# Altium schematic sheet Copia de UC3844 - CON TEST .SCHDOC
size 508 x 241 mm
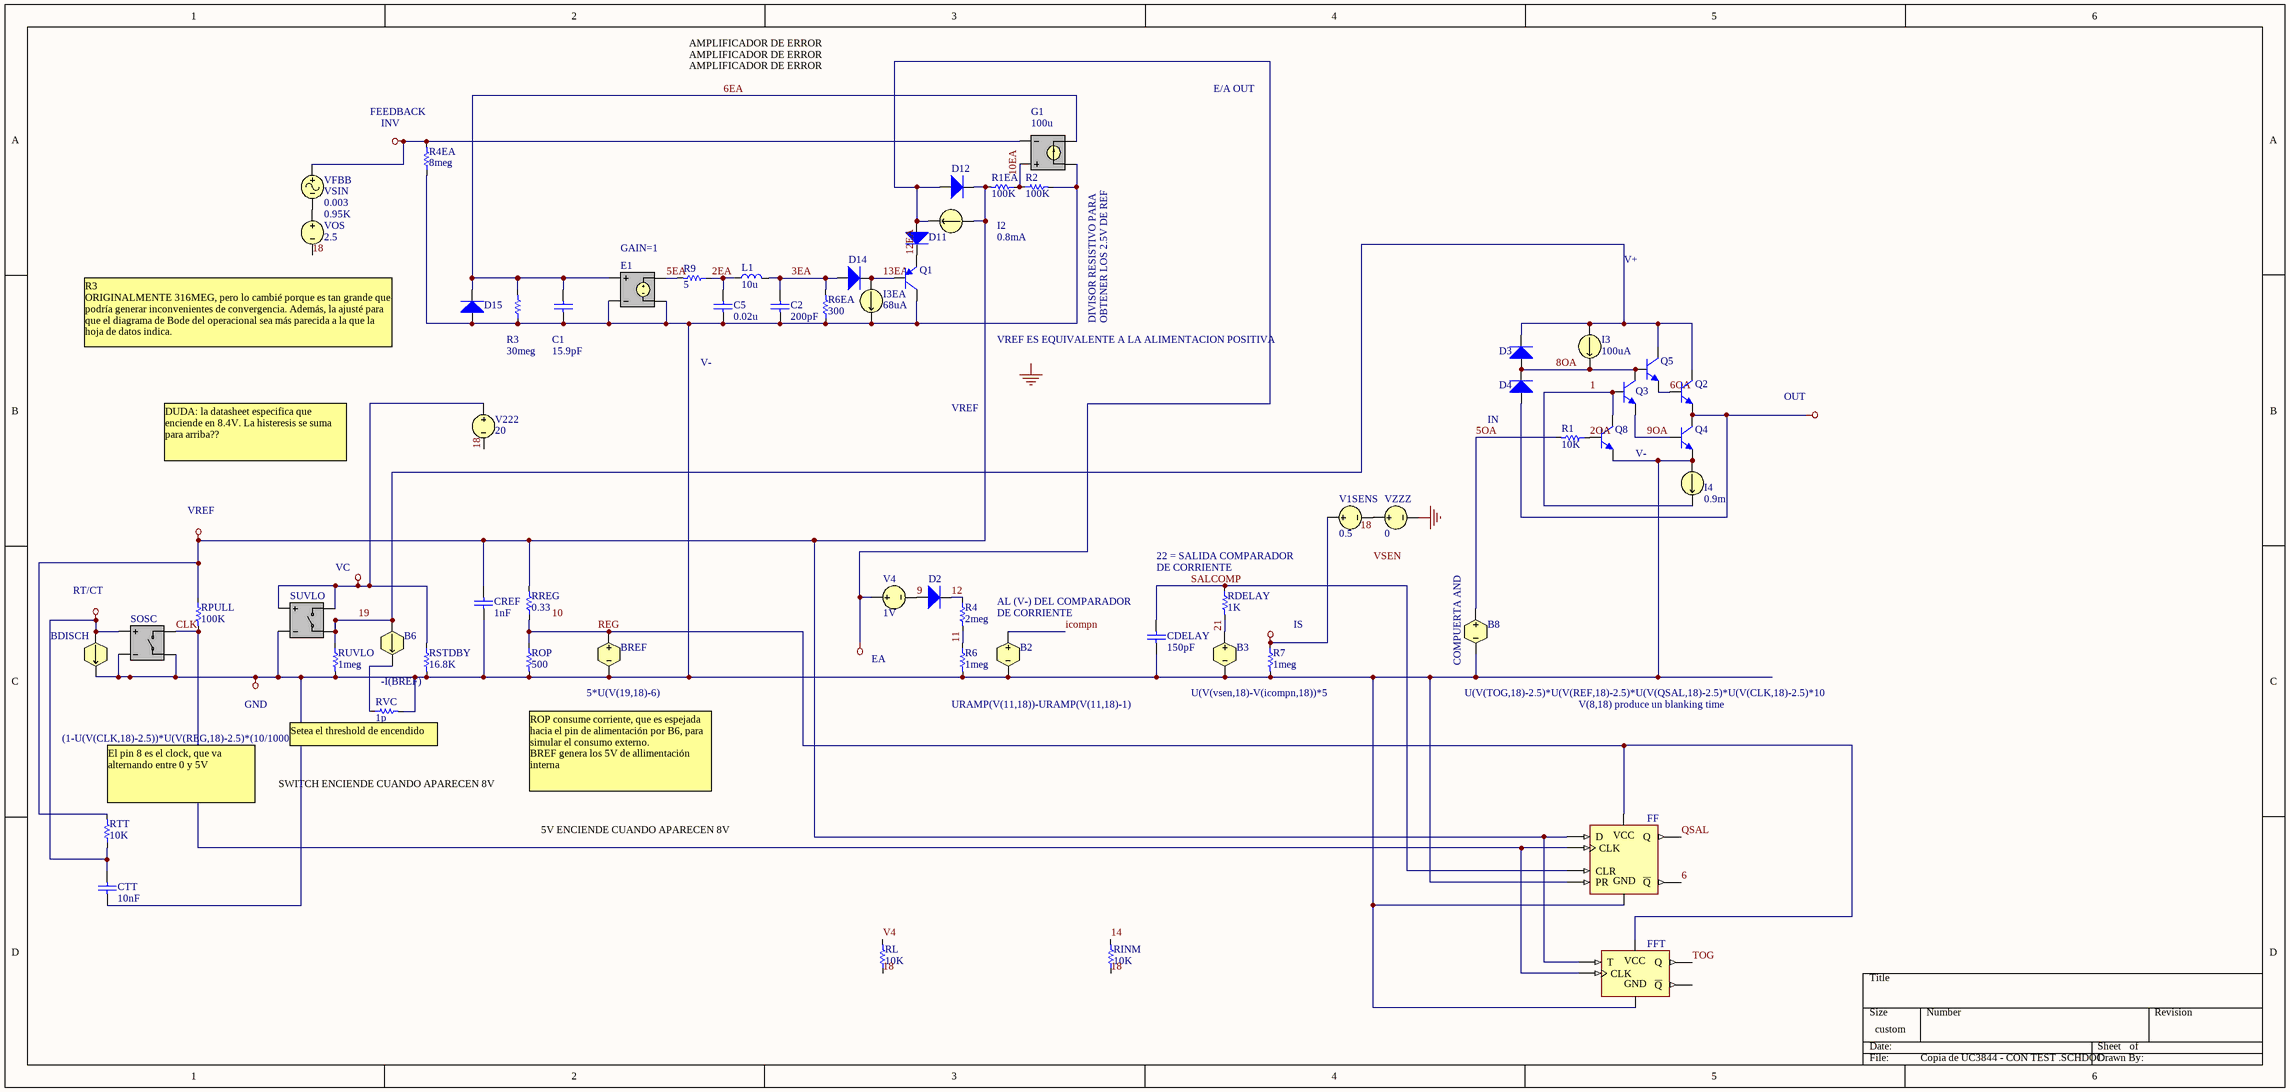
[diagram p0: Copia de UC3844 - CON TEST .SCHDOC]

## Parts
B2  Equation: URAMP(V(11,18))-URAMP(V(11,18)-1)  (hidden comment: BVSRC)
B3  Equation: U(V(vsen,18)-V(icompn,18))*5  (hidden comment: BVSRC)
B6  Equation: -I(BREF)  (hidden comment: BISRC)
B8  Equation: U(V(TOG,18)-2.5)*U(V(REF,18)-2.5)*U(V(QSAL,18)-2.5)*U(V(CLK,18)-2.5)*10  (hidden comment: BVSRC)
BDISCH  Equation: (1-U(V(CLK,18)-2.5))*U(V(REG,18)-2.5)*(10/1000)  (hidden comment: BISRC)
BREF  Equation: 5*U(V(19,18)-6)  (hidden comment: BVSRC)
C1  value 15.9pF  [0805]  (hidden comment: Cap)
C2  value 200pF  [0805]  (hidden comment: Cap)
C5  value 0.02u  [0805]  (hidden comment: Cap)
CDELAY  value 150pF  [0805]  (hidden comment: Cap)
CREF  value 1nF  [0805]  (hidden comment: Cap)
CTT  value 10nF  [0805]  (hidden comment: Cap)
D2  Diode  [diode400]  (value not drawn)
D3  Diode  [diode400]  (value not drawn)
D4  Diode  [diode400]  (value not drawn)
D11  Diode  [diode400]  (value not drawn)
D12  Diode  [diode400]  (value not drawn)
D14  Diode  [diode400]  (value not drawn)
D15  Diode  [diode400]  (value not drawn)
E1  ESRC  (value not drawn)
FF  FFSRV2  (value not drawn)
FFT  FFT  (value not drawn)
G1  Gain: 100u  (hidden comment: GSRC)
I2  value 0.8mA  (hidden comment: ISRC)
I3  value 100uA  (hidden comment: ISRC)
I3EA  value 68uA  (hidden comment: ISRC)
I4  value 0.9m  (hidden comment: ISRC)
L1  value 10u  [TOROIDE TN14-9-5]  (hidden comment: Inductor2)
Q1  PNP  [SOT23]  (value not drawn)
Q2  NPN  [SOT23]  (value not drawn)
Q3  NPN  [SOT23]  (value not drawn)
Q4  NPN  [SOT23]  (value not drawn)
Q5  NPN  [SOT23]  (value not drawn)
Q8  NPN  [SOT23]  (value not drawn)
R1  value 10K  [0805]  (hidden comment: Res)
R1EA  value 100K  [0805]  (hidden comment: Res)
R2  value 100K  [0805]  (hidden comment: Res)
R3  value 30meg  [0805]  (hidden comment: Res)
R4  value 2meg  [0805]  (hidden comment: Res)
R4EA  value 8meg  [0805]  (hidden comment: Res)
R6  value 1meg  [0805]  (hidden comment: Res)
R6EA  value 300  [0805]  (hidden comment: Res)
R7  value 1meg  [0805]  (hidden comment: Res)
R9  value 5  [0805]  (hidden comment: Res)
RDELAY  value 1K  [0805]  (hidden comment: Res)
RINM  value 10K  [0805]  (hidden comment: Res)
RL  value 10K  [0805]  (hidden comment: Res)
ROP  value 500  [0805]  (hidden comment: Res)
RPULL  value 100K  [0805]  (hidden comment: Res)
RREG  value 0.33  [0805]  (hidden comment: Res)
RSTDBY  value 16.8K  [0805]  (hidden comment: Res)
RTT  value 10K  [0805]  (hidden comment: Res)
RUVLO  value 1meg  [0805]  (hidden comment: Res)
RVC  value 1p  [0805]  (hidden comment: Res)
SOSC  VSW  (value not drawn)
SUVLO  VSW  (value not drawn)
V1SENS  value 0.5  (hidden comment: VSRC)
V4  value 1V  (hidden comment: VSRC)
V222  value 20  (hidden comment: VSRC)
VFBB  VSIN  Amplitude: 0.003  Frequency: 0.95K
VOS  value 2.5  (hidden comment: VSRC)
VZZZ  value 0  (hidden comment: VSRC)

## Nets
18: B2.2 B3.2 B8.2 BDISCH.2 BREF.2 C1.1 C2.1 C5.1 CDELAY.1 CREF.1 CTT.1 D15.1 E1.2(NC-) E1.4(N-) FF.4(PR) FF.7(GND) FFT.6(GND) G1.3(N+) I3EA.2 I4.1 Q1.1(C) Q4.3(E) Q8.3(E) R2.2 R3.1 R4EA.1 R6.2 R6EA.1 R7.2 RINM.1 RL.1 ROP.2 RSTDBY.2 RUVLO.2 RVC.2 SOSC.2(N1-) SOSC.4(N2-) SUVLO.2(N1-) V1SENS.2 V222.2 VOS.2 VZZZ.1
ALIM: RSTDBY.1 SUVLO.1(N1+) SUVLO.3(N2+) V222.1
EAOUT: D11.1 D12.1 I2.2 V4.1
FEED: G1.2(NC-) R4EA.2 VFBB.1
GND: VZZZ.2
OUT: D4.1 Q2.3(E) Q4.1(C)
REF: CREF.2 D12.2 FF.2(D) FFT.1(T) I2.1 R1EA.2 RPULL.1 RREG.2 RTT.2
RTCT: BDISCH.1 CTT.2 RTT.1 SOSC.1(N1+)
VSEN: R7.1 V1SENS.1
1: I4.2 Q3.2(B) Q8.1(C)
2EA: C5.2 L1.1 R9.1
2OA: Q8.2(B) R1.1
3EA: C2.2 D14.1 L1.2 R6EA.2
5EA: E1.3(N+) R9.2
5OA: B8.1 R1.2
6: FF.6(~{Q})
6EA: C1.2 D15.2 E1.1(NC+) G1.4(N-) R3.2
6OA: Q2.2(B) Q5.3(E)
8OA: D3.1 D4.2 I3.2 Q3.1(C) Q5.2(B)
9: D2.1 V4.2
9OA: Q3.3(E) Q4.2(B)
10EA: G1.1(NC+) R1EA.1 R2.1
11: R4.2 R6.1
12: D2.2 R4.1
12EA: D11.2 Q1.3(E)
13EA: D14.2 I3EA.1 Q1.2(B)
14: RINM.2
19: B6.1 D3.2 I3.1 Q2.1(C) Q5.1(C) RUVLO.1 SUVLO.4(N2-)
21: B3.1 RDELAY.2
CLK: FF.3(CLK) FFT.2(CLK) RPULL.2 SOSC.3(N2+)
icompn: B2.1
QSAL: FF.5(Q)
REG: BREF.1 FF.14(VCC) FFT.5(VCC) ROP.1 RREG.1
SALCOMP: CDELAY.2 FF.1(CLR) RDELAY.1
TOG: FFT.3(Q)
V4: RL.2
NetB6_2: B6.2 RVC.1
NetVFBB_2: VFBB.2 VOS.1

Not connected (* = marked no-connect by the designer): FFT 4(~{Q})

## Notes on the sheet
- AMPLIFICADOR DE ERROR
- (near R4EA) FEEDBACK
- (near R4EA) INV
- E/A OUT
- (near E1) GAIN=1
- V+
- (near VOS) R3
  ORIGINALMENTE 316MEG, pero lo cambié porque es tan grande que podría generar inconvenientes de convergencia. Además, la ajusté para que el diagrama de Bode del operacional sea más parecida a la que la hoja de datos indica.
- V-
- VREF ES EQUIVALENTE A LA ALIMENTACION POSITIVA
- DIVISOR RESISTIVO PARA
- OBTENER LOS 2.5V DE REF
- VREF
- (near D4) IN
- OUT
- DUDA: la datasheet especifica que enciende en 8.4V. La histeresis se suma para arriba??
- RT/CT
- (near SUVLO) VC
- (near RDELAY) 22 = SALIDA COMPARADOR
- (near RDELAY) DE CORRIENTE
- AL (V-) DEL COMPARADOR
- DE CORRIENTE
- (near R7) IS
- GND
- EA
- (near B8) COMPUERTA AND
- V(8,18) produce un blanking time
- (near RVC) Setea el threshold de encendido
- (near RTT) El pin 8 es el clock, que va alternando entre 0 y 5V
- SWITCH ENCIENDE CUANDO APARECEN 8V
- ROP consume corriente, que es espejada hacia el pin de alimentación por B6, para simular el consumo externo.
  BREF genera los 5V de allimentación interna
- 5V ENCIENDE CUANDO APARECEN 8V
- Labels drawn without touching a wire or pin: 10, GND, VSEN

## Library data of the parts
B2 B3 B8 BREF = BVSRC: Non-Linear Dependent Voltage Source; Note: PCB Footprint - Not required; Published: 8-Jun-2000; Revision: 17-Jul-2002: Re-released for DXP Platform.; Package Reference: Not Applicable; Publisher: Altium Limited
B6 BDISCH = BISRC: Non-Linear Dependent Current Source; Note: PCB Footprint - Not required; Published: 8-Jun-2000; Revision: 17-Jul-2002: Re-released for DXP Platform.; Package Reference: Not Applicable; Publisher: Altium Limited
C1 C2 C5 CDELAY CREF CTT = Cap: Capacitor; Voltage: 50V; Price: 0.25; Technology: Ceramic
D2-D4 D11 D12 D14 D15 = Diode: Diodo; Price: ?
E1 = ESRC: Voltage Controlled Voltage Source; Note: PCB Footprint - Not required; Published: 8-Jun-2000; Revision: 17-Jul-2002: Re-released for DXP Platform.; Package Reference: Not Applicable; Publisher: Altium Limited
FF = FFSRV2: D-Type Positive-Edge-Triggered Flip-Flop with Clear and Preset (simulación); Revision: 17-Jul-2002: Re-released for DXP Platform.
FFT = FFT: Positive-Edge-Triggered Flip-Flop T (simulación); Revision: 17-Jul-2002: Re-released for DXP Platform.
G1 = GSRC: Voltage Controlled Current Source; Note: PCB Footprint - Not required; Published: 8-Jun-2000; Revision: 17-Jul-2002: Re-released for DXP Platform.; Package Reference: Not Applicable; Publisher: Altium Limited
I2 I3 I3EA I4 = ISRC: Current Source; Note: PCB Footprint - Not required; Published: 8-Jun-2000; Revision: 17-Jul-2002: Re-released for DXP Platform.; Package Reference: Not Applicable; Publisher: Altium Limited
L1 = Inductor2: Inductor; Revision: July-2002: Re-released for DXP Platform.
Q1 = PNP: PNP Bipolar Transistor; pin to pad: 1>3 2>1 3>2; Price: 0.3267
Q2-Q5 Q8 = NPN: NPN Bipolar Transistor; pin to pad: 1>3 2>1 3>2; Price: 0.38
R1 R1EA R2-R4 R4EA R6 R6EA R7 R9 RDELAY RINM RL ROP RPULL RREG RSTDBY RTT RUVLO RVC = Res: Resistor; Power: 0.25W; Price: 0.036
SOSC SUVLO = VSW: Voltage Controlled Switch (simulación); Revision: 17-Jul-2002: Re-released for DXP Platform.
V1SENS V4 V222 VOS VZZZ = VSRC: Voltage Source; Note: PCB Footprint - Not required; Published: 8-Jun-2000; Revision: 17-Jul-2002: Re-released for DXP Platform.; Package Reference: Not Applicable; Publisher: Altium Limited
VFBB = VSIN: Sinusoidal Voltage Source; Revision 1: 15-Jun-2001: Default value added for damping factor (F8:0).; Revision 2: 17-July-2002: Re-released for DXP Platform.; Note: PCB Footprint - Not required; Published: 8-Jun-2000; Package Reference: Not Applicable; Publisher: Altium Limited